# EAGLE design fealac_v1 (EAGLE 7.4.0)
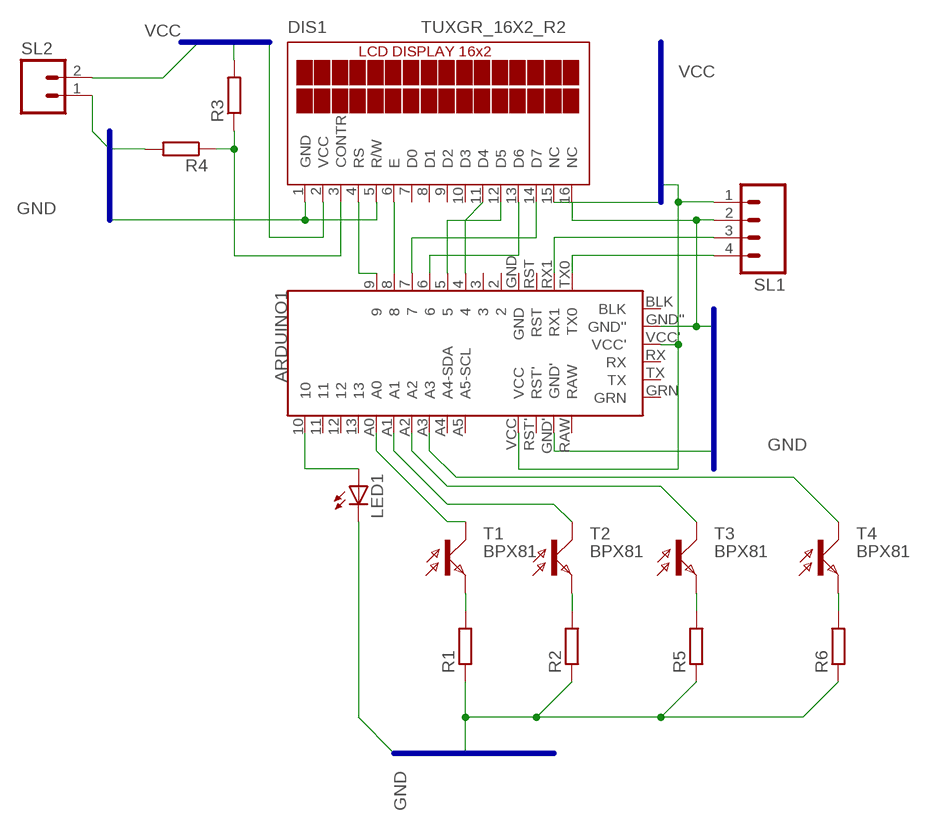
[diagram p0: schematic, sheet 1]

## Parts
ARDUINO1  ARDUINO_PRO_MINI_V2  [ARDUINO_PRO_MINI_V2]
DIS1  TUXGR_16X2_R2  [TUXGR_16X2_R2]
LED1  LED3MM  [LED3MM]
R1  R-EU_0204/7  [0204/7]
R2  R-EU_0204/7  [0204/7]
R3  R-EU_0204/7  [0204/7]
R4  R-EU_0204/7  [0204/7]
R5  R-EU_0204/7  [0204/7]
R6  R-EU_0204/7  [0204/7]
SL1  M04  [04P]
SL2  M02  [02P]
T1  BPX81  [BPX81]
T2  BPX81  [BPX81]
T3  BPX81  [BPX81]
T4  BPX81  [BPX81]

## Nets
GND: ARDUINO1.GND' ARDUINO1.GND'' DIS1.1(GND) DIS1.5(R/W) DIS1.16(NC) LED1.K(C) R1.1 R2.1 R4.2 R5.1 R6.1 SL1.2 SL2.1
N$1: DIS1.3(CONTR) R3.1 R4.1
N$2: ARDUINO1.4 DIS1.11(D4)
N$3: R1.2 T1.E
N$4: ARDUINO1.RX1 SL1.3
N$5: ARDUINO1.TX0 SL1.4
N$6: ARDUINO1.10 LED1.A
N$7: R6.2 T4.E
N$8: ARDUINO1.9 DIS1.4(RS)
N$9: ARDUINO1.8 DIS1.6(E)
N$10: ARDUINO1.7 DIS1.14(D7)
N$11: ARDUINO1.6 DIS1.13(D6)
N$12: ARDUINO1.5 DIS1.12(D5)
N$13: R2.2 T2.E
N$14: R5.2 T3.E
N$15: ARDUINO1.A0 T1.C
N$16: ARDUINO1.A1 T2.C
N$17: ARDUINO1.A2 T3.C
N$18: ARDUINO1.A3 T4.C
VCC: ARDUINO1.VCC ARDUINO1.VCC' DIS1.2(VCC) DIS1.15(NC) R3.2 SL1.1 SL2.2
Unconnected: ARDUINO1.2 ARDUINO1.3 ARDUINO1.11 ARDUINO1.12 ARDUINO1.13 ARDUINO1.A4(A4-SDA) ARDUINO1.A5(A5-SCL) ARDUINO1.BLK ARDUINO1.GND ARDUINO1.GRN ARDUINO1.RAW ARDUINO1.RST ARDUINO1.RST' ARDUINO1.RX ARDUINO1.TX DIS1.7(D0) DIS1.8(D1) DIS1.9(D2) DIS1.10(D3)

## Buses
VCC
GND

## Library data of the parts
ARDUINO1 = Arduino_Pro_Mini:ARDUINO_PRO_MINI_V2
DIS1 = display-lcd:TUXGR_16X2_R2: Tuxgraphics LCD display 16x2 characters reflective, without background light Source: tuxgr_12x2_r2.pdf; OC_FARNELL: unknown; OC_NEWARK: unknown
LED1 = led:LED: LED OSRAM: - CHIPLED LG R971, LG N971, LY N971, LG Q971, LY Q971, LO R971, LY R971 LH N974, LH R974 LS Q976, LO Q976, LY Q976 LO Q996 - Hyper CHIPLED LW Q18S LB Q993, LB Q99A, LB R99A - SideLED LS A670, LO A670, LY A670, LG A670, LP A670 LB A673, LV A673, LT A673, LW A673 LH A674 LY A675 LS A676, LA A676, LO A676, LY A676, LW A676 LS A679, LY A679, LG A679 - Hyper Micro SIDELED® LS Y876, LA Y876, LO Y876, LY Y876 LT Y87S - SmartLED LW L88C, LW L88S LB L89C, LB L89S, LG L890 LS L89K, LO L89K, LY L89K LS L896, LA L896, LO L896, LY L896 - TOPLED LS T670, LO T670, LY T670, LG T670, LP T670 LSG T670, LSP T670, LSY T670, LOP T670, LYG T670 LG T671, LOG T671, LSG T671 LB T673, LV T673, LT T673, LW T673 LH T674 LS T676, LA T676, LO T676, LY T676, LB T676, LH T676, LSB T676, LW T676 LB T67C, LV T67C, LT T67C, LS T67K, LO T67K, LY T67K, LW E67C LS E67B, LA E67B, LO E67B, LY E67B, LB E67C, LV E67C, LT E67C LW T67C LS T679, LY T679, LG T679 LS T770, LO T770, LY T770, LG T770, LP T770 LB T773, LV T773, LT T773, LW T773 LH T774 LS E675, LA E675, LY E675, LS T675 LS T776, LA T776, LO T776, LY T776, LB T776 LHGB T686 LT T68C, LB T68C - Hyper Mini TOPLED® LB M676 - Mini TOPLED Santana® LG M470 LS M47K, LO M47K, LY M47K Source: http://www.osram.convergy.de LUXEON: - LUMILED® LXK2-PW12-R00, LXK2-PW12-S00, LXK2-PW14-U00, LXK2-PW14-V00 LXK2-PM12-R00, LXK2-PM12-S00, LXK2-PM14-U00 LXK2-PE12-Q00, LXK2-PE12-R00, LXK2-PE12-S00, LXK2-PE14-T00, LXK2-PE14-U00 LXK2-PB12-K00, LXK2-PB12-L00, LXK2-PB12-M00, LXK2-PB14-N00, LXK2-PB14-P00, LXK2-PB14-Q00 LXK2-PR12-L00, LXK2-PR12-M00, LXK2-PR14-Q00, LXK2-PR14-R00 LXK2-PD12-Q00, LXK2-PD12-R00, LXK2-PD12-S00 LXK2-PH12-R00, LXK2-PH12-S00 LXK2-PL12-P00, LXK2-PL12-Q00, LXK2-PL12-R00 Source: www.luxeon.com KINGBRIGHT: KA-3528ASYC Source: www.kingbright.com
R1-R6 = rcl:R-EU_: RESISTOR, European symbol
SL1 = con-amp-quick:M04: AMP QUICK CONNECTOR; OC_FARNELL: unknown; OC_NEWARK: unknown
SL2 = con-amp-quick:M02: AMP QUICK CONNECTOR; OC_FARNELL: unknown; OC_NEWARK: unknown
T1-T4 = opto-trans-siemens:BPX81: PHOTO TRANSISTOR; OC_FARNELL: unknown; OC_NEWARK: unknown

## Board
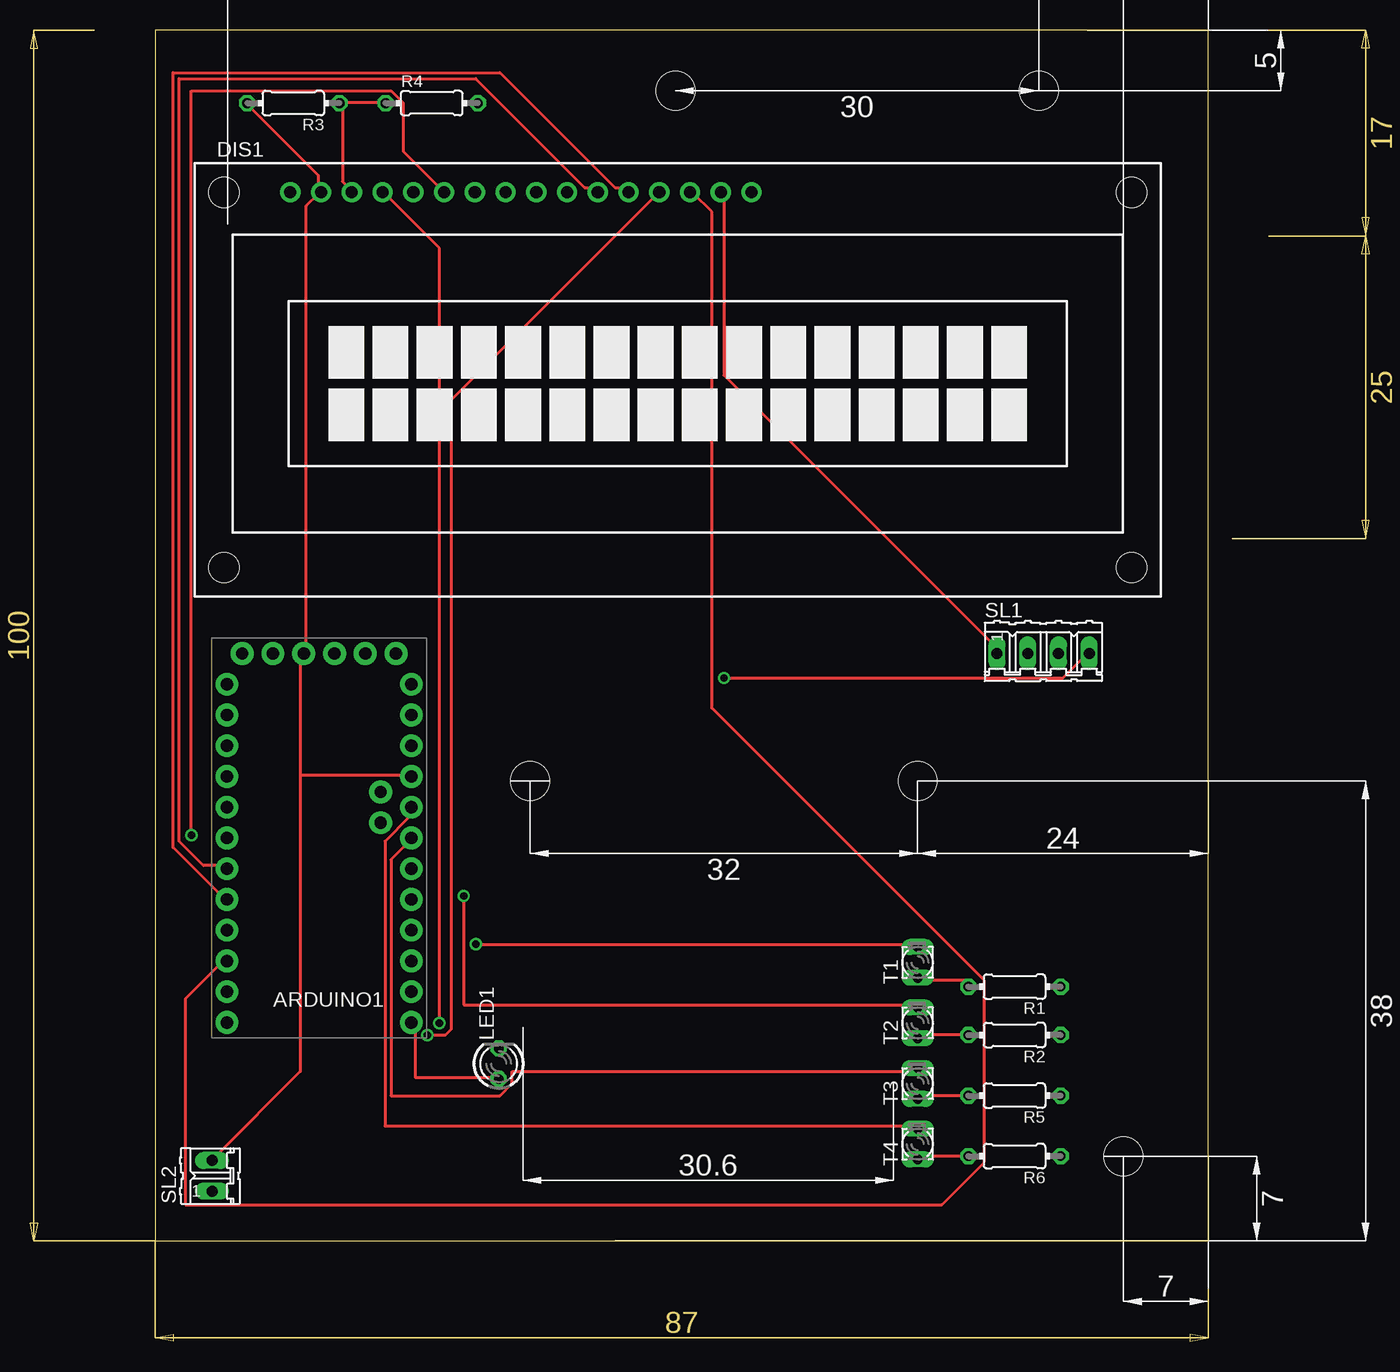
[diagram p1: board, top side]
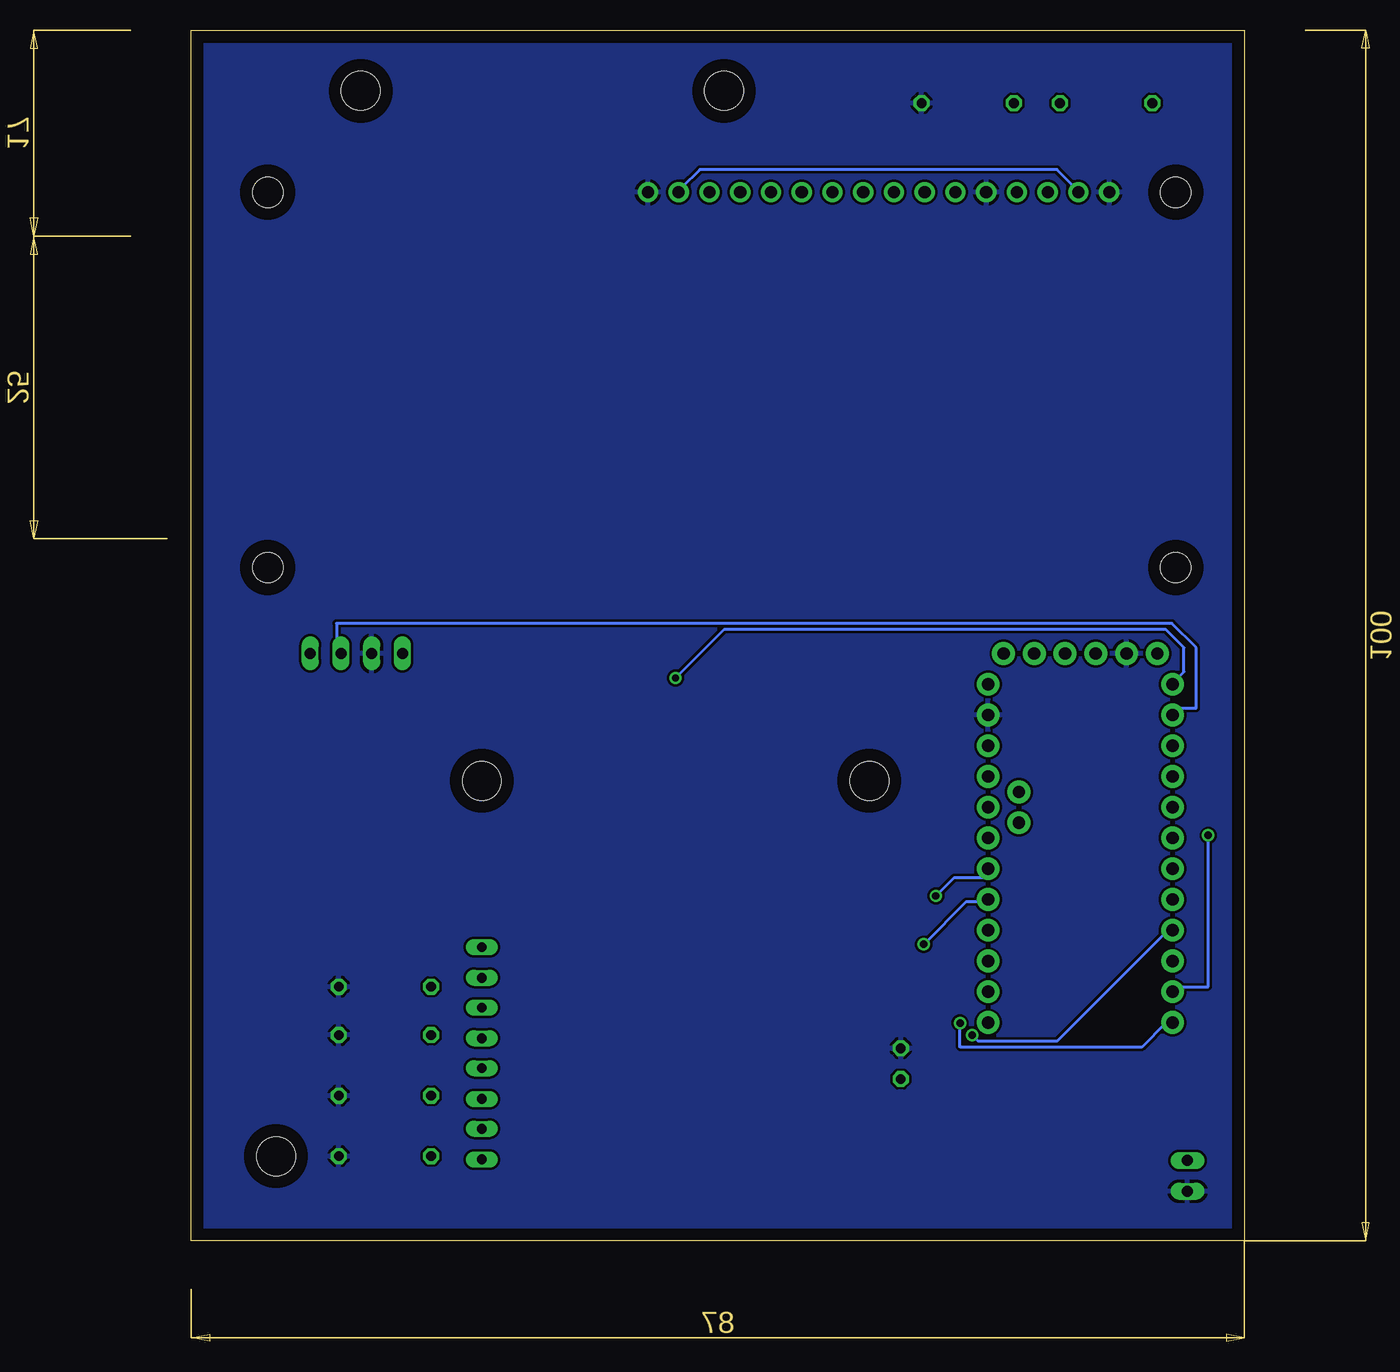
[diagram p2: board, bottom side, seen from below]

Size 87 x 100 mm. Coordinates in mm from the lower left corner, seen from the top.
Outline: 0,0 87,0 87,100 0,100 0,0
Copper layers (1*16): Top 0.035mm / dielectric 1.5mm / Bottom 0.035mm
Design rules "default": minimum track width 10mil, minimum drill 24mil, track to track 8mil, track to pad 8mil, pad to pad 8mil, via to via 8mil, smd to smd 8mil, copper to edge 40mil, drill to drill 8mil, minimum pad ring 10mil, minimum via ring 8mil, stop-mask expansion 4mil, vias tented up to drill 0mil, thermal gap 10mil
Holes 3.2 mm at 43,95 73,95 80,7 31,38 63,38

### Footprints (pad centres in the part's own frame; a part is rotated, then mirrored left to right if it is on the bottom)
ARDUINO_PRO_MINI_V2 = drill 1.016 pad 1.88: 2 -7.62,2.54; 3 -7.62,0; 4 -7.62,-2.54; 5 -7.62,-5.08; 6 -7.62,-7.62; 7 -7.62,-10.16; 8 -7.62,-12.7; 9 -7.62,-15.24; 10 7.62,-15.24; 11 7.62,-12.7; 12 7.62,-10.16; 13 7.62,-7.62; A0 7.62,-5.08; A1 7.62,-2.54; A2 7.62,0; A3 7.62,2.54; A4 5.08,1.27; A5 5.08,3.81; BLK -6.35,15.24; GND -7.62,5.08; GND' 7.62,10.16; GND'' -3.81,15.24; GRN 6.35,15.24; RAW 7.62,12.7; RST -7.62,7.62; RST' 7.62,7.62; RX 1.27,15.24; RX1 -7.62,10.16; TX 3.81,15.24; TX0 -7.62,12.7; VCC 7.62,5.08; VCC' -1.27,15.24
TUXGR_16X2_R2 = drill 1 pad 1.676: 1 -32,15.5; 2 -29.46,15.5; 3 -26.92,15.5; 4 -24.38,15.5; 5 -21.84,15.5; 6 -19.3,15.5; 7 -16.76,15.5; 8 -14.22,15.5; 9 -11.68,15.5; 10 -9.14,15.5; 11 -6.6,15.5; 12 -4.06,15.5; 13 -1.52,15.5; 14 1.02,15.5; 15 3.56,15.5; 16 6.1,15.5 | hole 2.5: -37.5,-15.5; 37.5,-15.5; -37.5,15.5; 37.5,15.5
LED3MM = drill 0.813 octagon: A -1.27,0; K 1.27,0
0204/7 = drill 0.813 octagon: 1 -3.81,0; 2 3.81,0
04P = drill 0.914 long: 1 -3.81,0; 2 -1.27,0; 3 1.27,0; 4 3.81,0
02P = drill 0.914 long: 1 -1.27,0; 2 1.27,0
BPX81 = drill 0.813 long: C 1.27,0; E -1.27,0

### Placement (x,y rotation side)
ARDUINO1  13.56,33.28 0 top
DIS1  43.18,71.12 0 top
LED1  28.4,14.64 90 top
R1  71,21 180 top
R2  71,17 180 top
R3  11.43,93.98 180 top
R4  22.86,93.98 0 top
R5  71,12 180 top
R6  71,7 180 top
SL1  73.37,48.53 0 top
SL2  4.71,5.37 90 top
T1  63,23 90 top
T2  63,18 90 top
T3  63,13 90 top
T4  63,8 90 top

### Tracks (layer width: path | path; a pad name or v marks a point on that pad's centre or on a via)
GND
  pour Bottom: 0,0 86.36,0 86.36,99.06 0,99.06
N$1
  Top 0.254: R4.1 19,94 15.5,94 R3.1 15.5,93.5 15.5,87.5 16,87 DIS1.3
N$2
  Top 0.254: DIS1.11 36.5,87 35.5,87 26.5,96 2,96 2,33 4,31 5.5,31 ARDUINO1.4
N$3
  Top 0.254: T1.E 63,21.5 67,21.5 67,21 R1.2
N$4
  Bottom 0.254: SL1.3 75,49 75,51 6,51 4,49 4,44 5.5,44 6,43.5 ARDUINO1.RX1
N$5  (via drill 0.61)
  Top 0.254: v47,46.5 75,46.5 77,48.5 SL1.4
  Bottom 0.254: v47,46.5 43,50.5 6.5,50.5 5,49 5,47 6,46 ARDUINO1.TX0
N$6
  Top 0.254: LED1.A 28,13.5 21.5,13.5 21.5,18 ARDUINO1.10
N$7
  Top 0.254: R6.2 63,7 T4.E
N$8  (via drill 0.61)
  Top 0.254: v23.5,18 23.5,82 19,86.5 DIS1.4
  Bottom 0.254: v23.5,18 23.5,16 8.5,16 6.5,18 6,18 ARDUINO1.9
N$9  (via drill 0.61)
  Top 0.254: DIS1.6 20.5,90 20.5,94 19.5,95 3,95 v3,33.5
  Bottom 0.254: v3,33.5 3,21 5.5,21 ARDUINO1.8
N$10
  Top 0.254: DIS1.14 44.5,86.5 46,85 46,44 68.5,21.5 68.5,6.5 65,3 2.5,3 2.5,20 5.5,23 ARDUINO1.7
N$11  (via drill 0.61)
  Top 0.254: v22.5,17 24,17 24.5,17.5 24.5,69.5 41.5,86.5 DIS1.13
  Bottom 0.254: v22.5,17 22,16.5 15.5,16.5 6.5,25.5 6,25.5 ARDUINO1.6
N$12
  Top 0.254: DIS1.12 39,87 38,87 28.5,96.5 1.5,96.5 1.5,32.5 5.5,28.5 ARDUINO1.5
N$13
  Top 0.254: R2.2 63,17 T2.E
N$14
  Top 0.254: R5.2 63,12 T3.E
N$15  (via drill 0.61)
  Top 0.254: v26.5,24.5 63,24.5 T1.C
  Bottom 0.254: v26.5,24.5 23,28 21.5,28 ARDUINO1.A0
N$16  (via drill 0.61)
  Top 0.254: v25.5,28.5 25.5,19.5 63,19.5 T2.C
  Bottom 0.254: v25.5,28.5 24,30 21.5,30 21,30.5 ARDUINO1.A1
N$17
  Top 0.254: T3.C 63,14 29.5,14 29.5,13 28.5,12 19.5,12 19.5,31.5 21,33 ARDUINO1.A2
N$18
  Top 0.254: T4.C 63,9.5 19,9.5 19,33 21,35 21,35.5 ARDUINO1.A3
VCC
  Top 0.254: SL1.1 69.5,49 47,71.5 47,86.5 DIS1.15 | R3.2 8,93.5 13.5,88 13.5,87 DIS1.2 13.5,86.5 12.5,85.5 12.5,49 ARDUINO1.VCC' 12,48.5 12,38.5 | 12,38.5 12,14 5,7 SL2.2 | 12,38.5 21,38.5 ARDUINO1.VCC
  Bottom 0.254: DIS1.15 46.5,87 45,88.5 15.5,88.5 14,87 DIS1.2